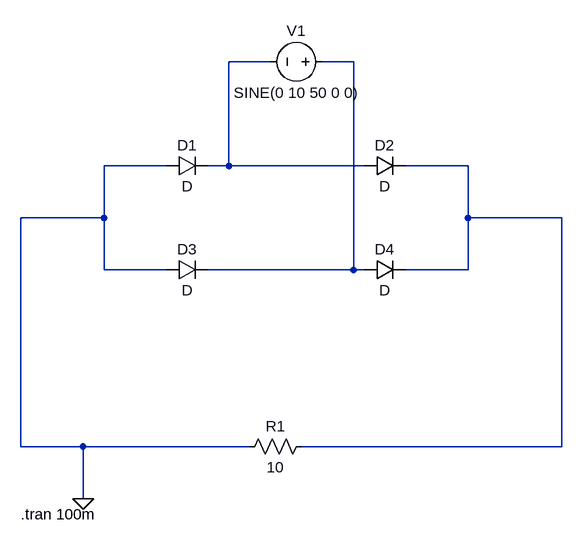
[diagram p0: schematic diode_only.asc]
diode_only.asc, the LTspice schematic file:
Version 4.1
SHEET 1 880 680
WIRE 288 -208 224 -208
WIRE 416 -208 368 -208
WIRE 128 -48 32 -48
WIRE 224 -48 224 -208
WIRE 224 -48 192 -48
WIRE 432 -48 224 -48
WIRE 592 -48 496 -48
WIRE 32 32 32 -48
WIRE 32 32 -96 32
WIRE 592 32 592 -48
WIRE 736 32 592 32
WIRE 32 112 32 32
WIRE 128 112 32 112
WIRE 416 112 416 -208
WIRE 416 112 192 112
WIRE 432 112 416 112
WIRE 592 112 592 32
WIRE 592 112 496 112
WIRE -96 384 -96 32
WIRE 0 384 -96 384
WIRE 256 384 0 384
WIRE 736 384 736 32
WIRE 736 384 336 384
WIRE 0 464 0 384
FLAG 0 464 0
SYMBOL voltage 384 -208 R90
WINDOW 0 -32 56 VBottom 2
WINDOW 3 32 56 VTop 2
WINDOW 123 0 0 Left 0
WINDOW 39 0 0 Left 0
SYMATTR InstName V1
SYMATTR Value SINE(0 10 50 0 0)
SYMBOL diode 128 -32 R270
WINDOW 0 32 32 VTop 2
WINDOW 3 0 32 VBottom 2
SYMATTR InstName D1
SYMBOL diode 432 -32 R270
WINDOW 0 32 32 VTop 2
WINDOW 3 0 32 VBottom 2
SYMATTR InstName D2
SYMBOL diode 128 128 R270
WINDOW 0 32 32 VTop 2
WINDOW 3 0 32 VBottom 2
SYMATTR InstName D3
SYMBOL diode 432 128 R270
WINDOW 0 32 32 VTop 2
WINDOW 3 0 32 VBottom 2
SYMATTR InstName D4
SYMBOL res 352 368 R90
WINDOW 0 0 56 VBottom 2
WINDOW 3 32 56 VTop 2
SYMATTR InstName R1
SYMATTR Value 10
TEXT -96 488 Left 2 !.tran 100m

The netlist it stands for:
* diode_only.asc
V1 N002 N001 SINE(0 10 50 0 0)
D1 0 N001 D
D2 N001 N003 D
D3 0 N002 D
D4 N002 N003 D
R1 N003 0 10
.model D D
.lib standard.dio
.tran 100m
.backanno
.end